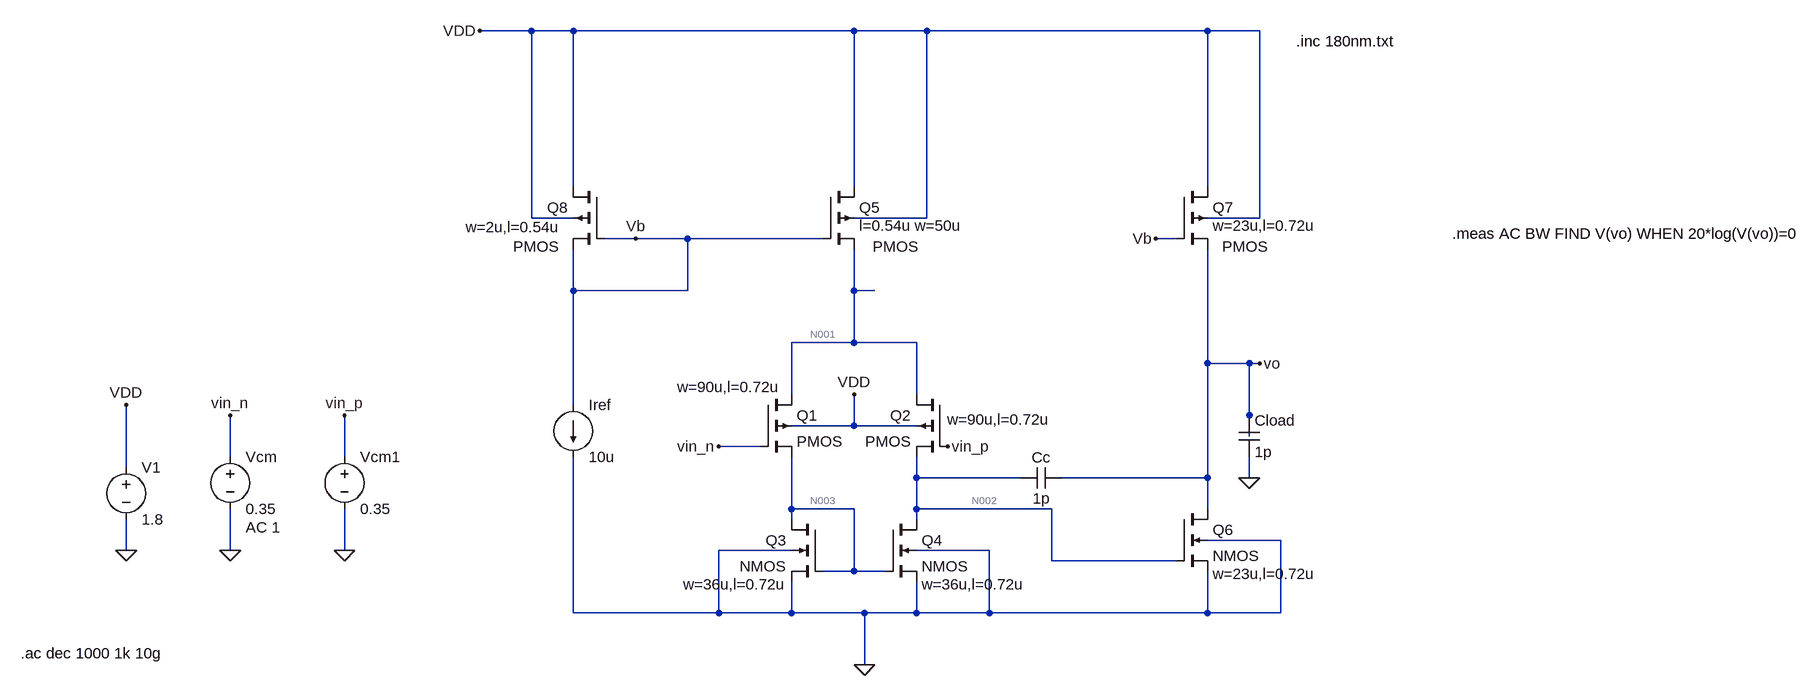
[diagram p0: schematic project.asc]
project.asc, the LTspice schematic file:
Version 4
SHEET 1 1656 680
WIRE -336 -464 -416 -464
WIRE -272 -464 -336 -464
WIRE 160 -464 -272 -464
WIRE 272 -464 160 -464
WIRE 704 -464 272 -464
WIRE 784 -464 704 -464
WIRE -272 -224 -272 -464
WIRE 160 -224 160 -464
WIRE 704 -224 704 -464
WIRE -336 -176 -336 -464
WIRE -272 -176 -336 -176
WIRE 272 -176 272 -464
WIRE 272 -176 160 -176
WIRE 784 -176 784 -464
WIRE 784 -176 704 -176
WIRE -176 -144 -224 -144
WIRE -96 -144 -176 -144
WIRE 112 -144 -96 -144
WIRE 656 -144 624 -144
WIRE -272 -64 -272 -128
WIRE -96 -64 -96 -144
WIRE -96 -64 -272 -64
WIRE 160 -64 160 -128
WIRE 192 -64 160 -64
WIRE 160 16 160 -64
WIRE 160 16 64 16
WIRE 256 16 160 16
WIRE 704 48 704 -128
WIRE 768 48 704 48
WIRE 784 48 768 48
WIRE 64 96 64 16
WIRE 256 96 256 16
WIRE -272 112 -272 -64
WIRE 768 128 768 48
WIRE 160 144 160 96
WIRE 160 144 64 144
WIRE 256 144 160 144
WIRE 768 160 768 128
WIRE 16 176 -48 176
WIRE -800 192 -800 128
WIRE -624 192 -624 128
WIRE -960 208 -960 112
WIRE 256 224 256 192
WIRE 416 224 256 224
WIRE 704 224 704 48
WIRE 704 224 480 224
WIRE 768 224 768 192
WIRE 64 272 64 192
WIRE 160 272 64 272
WIRE 256 272 256 224
WIRE 464 272 256 272
WIRE 704 272 704 224
WIRE 64 288 64 272
WIRE 256 288 256 272
WIRE 816 320 704 320
WIRE -960 336 -960 288
WIRE -800 336 -800 272
WIRE -624 336 -624 272
WIRE 64 336 -48 336
WIRE 368 336 256 336
WIRE 464 352 464 272
WIRE 656 352 464 352
WIRE 160 368 160 272
WIRE 160 368 112 368
WIRE 208 368 160 368
WIRE -272 432 -272 192
WIRE -48 432 -48 336
WIRE -48 432 -272 432
WIRE 64 432 64 384
WIRE 64 432 -48 432
WIRE 176 432 64 432
WIRE 256 432 256 384
WIRE 256 432 176 432
WIRE 368 432 368 336
WIRE 368 432 256 432
WIRE 704 432 704 368
WIRE 704 432 368 432
WIRE 816 432 816 320
WIRE 816 432 704 432
WIRE 176 512 176 432
FLAG -48 176 vin_n
FLAG 304 176 vin_p
FLAG -416 -464 VDD
FLAG 784 48 vo
FLAG -800 336 0
FLAG -624 336 0
FLAG -800 128 vin_n
FLAG -624 128 vin_p
FLAG -960 336 0
FLAG -960 112 VDD
FLAG 768 224 0
FLAG 176 512 0
FLAG 160 96 VDD
FLAG -176 -144 Vb
FLAG 624 -144 Vb
DATAFLAG 160 -64 ""
DATAFLAG 720 48 ""
DATAFLAG 544 352 ""
DATAFLAG 128 272 ""
DATAFLAG 176 -256 "Id(Q5)"
DATAFLAG 64 16 "Id(Q1)"
DATAFLAG 704 -288 "Id(Q7)"
DATAFLAG -96 -144 ""
SYMBOL pmos4 -224 -224 M0
WINDOW 3 70 92 Left 2
WINDOW 123 68 62 Left 2
SYMATTR InstName Q8
SYMATTR Value2 w=2u,l=0.54u
SYMBOL pmos4 112 -224 R0
WINDOW 3 77 92 Left 2
WINDOW 123 56 60 Left 2
SYMATTR InstName Q5
SYMATTR Value2 l=0.54u w=50u
SYMBOL pmos4 656 -224 R0
WINDOW 3 70 92 Left 2
WINDOW 123 56 60 Left 2
SYMATTR InstName Q7
SYMATTR Value2 w=23u,l=0.72u
SYMBOL pmos4 16 96 R0
WINDOW 123 287 38 Left 2
SYMATTR InstName Q1
SYMATTR Value2 w=90u,l=0.72u
SYMBOL pmos4 304 96 M0
WINDOW 123 257 -12 Left 2
SYMATTR InstName Q2
SYMATTR Value2 w=90u,l=0.72u
SYMBOL nmos4 112 288 M0
WINDOW 123 56 100 Left 2
SYMATTR InstName Q3
SYMATTR Value2 w=36u,l=0.72u
SYMBOL nmos4 208 288 R0
WINDOW 123 56 100 Left 2
SYMATTR InstName Q4
SYMATTR Value2 w=36u,l=0.72u
SYMBOL nmos4 656 272 R0
WINDOW 123 56 100 Left 2
SYMATTR InstName Q6
SYMATTR Value2 w=23u,l=0.72u
SYMBOL cap 480 208 R90
WINDOW 0 0 32 VBottom 2
WINDOW 3 32 32 VTop 2
SYMATTR InstName Cc
SYMATTR Value 1p
SYMBOL voltage -800 176 R0
WINDOW 123 24 124 Left 2
WINDOW 39 0 0 Left 0
SYMATTR InstName Vcm
SYMATTR Value 0.35
SYMATTR Value2 AC 1
SYMBOL voltage -624 176 R0
WINDOW 123 24 124 Left 2
WINDOW 39 0 0 Left 0
SYMATTR InstName Vcm1
SYMATTR Value 0.35
SYMBOL voltage -960 192 R0
SYMATTR InstName V1
SYMATTR Value 1.8
SYMBOL current -272 112 R0
WINDOW 123 0 0 Left 0
WINDOW 39 0 0 Left 0
SYMATTR InstName Iref
SYMATTR Value 10u
SYMBOL cap 752 128 R0
SYMATTR InstName Cload
SYMATTR Value 1p
TEXT 840 -448 Left 2 !.inc 180nm.txt
TEXT -1122 494 Left 2 !.ac dec 1000 1k 10g
TEXT 1080 -152 Left 2 !.meas AC BW FIND V(vo) WHEN 20*log(V(vo))=0

The netlist it stands for:
* project.asc
M§Q8 VDD Vb Vb VDD PMOS w=2u,l=0.54u
M§Q5 VDD Vb N001 VDD PMOS l=0.54u w=50u
M§Q7 VDD Vb vo VDD PMOS w=23u,l=0.72u
M§Q1 N001 vin_n N003 VDD PMOS w=90u,l=0.72u
M§Q2 N001 vin_p N002 VDD PMOS w=90u,l=0.72u
M§Q3 N003 N003 0 0 NMOS w=36u,l=0.72u
M§Q4 N002 N003 0 0 NMOS w=36u,l=0.72u
M§Q6 vo N002 0 0 NMOS w=23u,l=0.72u
Cc vo N002 1p
Vcm vin_n 0 0.35 AC 1
Vcm1 vin_p 0 0.35
V1 VDD 0 1.8
Iref Vb 0 10u
Cload vo 0 1p
.model NMOS NMOS
.model PMOS PMOS
.lib standard.mos
.inc 180nm.txt
.ac dec 1000 1k 10g
.meas AC BW FIND V(vo) WHEN 20*log(V(vo))=0
.backanno
.end

* Results of the author's LTspice run, read from the files saved beside the schematic
* Operating Point, zero values left out:
*   V(vdd) = 1.8 V
*   V(vb) = 1.023 V
*   V(n001) = 1.157 V
*   V(vo) = 1.178 V
*   V(vin_n) = 350 mV
*   V(n003) = 573 mV
*   V(vin_p) = 350 mV
*   V(n002) = 573 mV
*   Id(Q6) = 84.22 µA
*   Ib(Q6) = -1.188 pA
*   Is(Q6) = -84.22 µA
*   Id(Q4) = 121.4 µA
*   Is(Q4) = -121.4 µA
*   Id(Q3) = 121.4 µA
*   Is(Q3) = -121.4 µA
*   Id(Q2) = 121.4 µA
*   Ib(Q2) = 1.89 pA
*   Is(Q2) = -121.4 µA
*   Id(Q1) = 121.4 µA
*   Ib(Q1) = 1.89 pA
*   Is(Q1) = -121.4 µA
*   Id(Q7) = 84.22 µA
*   Is(Q7) = -84.22 µA
*   Id(Q5) = 242.7 µA
*   Is(Q5) = -242.7 µA
*   Id(Q8) = 10 µA
*   Is(Q8) = -10 µA
*   I(Iref) = 10 µA
*   I(V1) = -336.9 µA
* From the log:
*   bw: v(vo)=(4.60227e-007dB,-11.8379°) at 1.50194e+008